# Altium schematic sheet MAIN.SchDoc
size A3; Organization: Electronic Research & Design; Address1: 11 Granofier; Address2: Zwartkop; Address3: Centurion; Address4: South Africa; Revision: 1; SheetNumber: 1; SheetTotal: 1; ProjectName: Flir
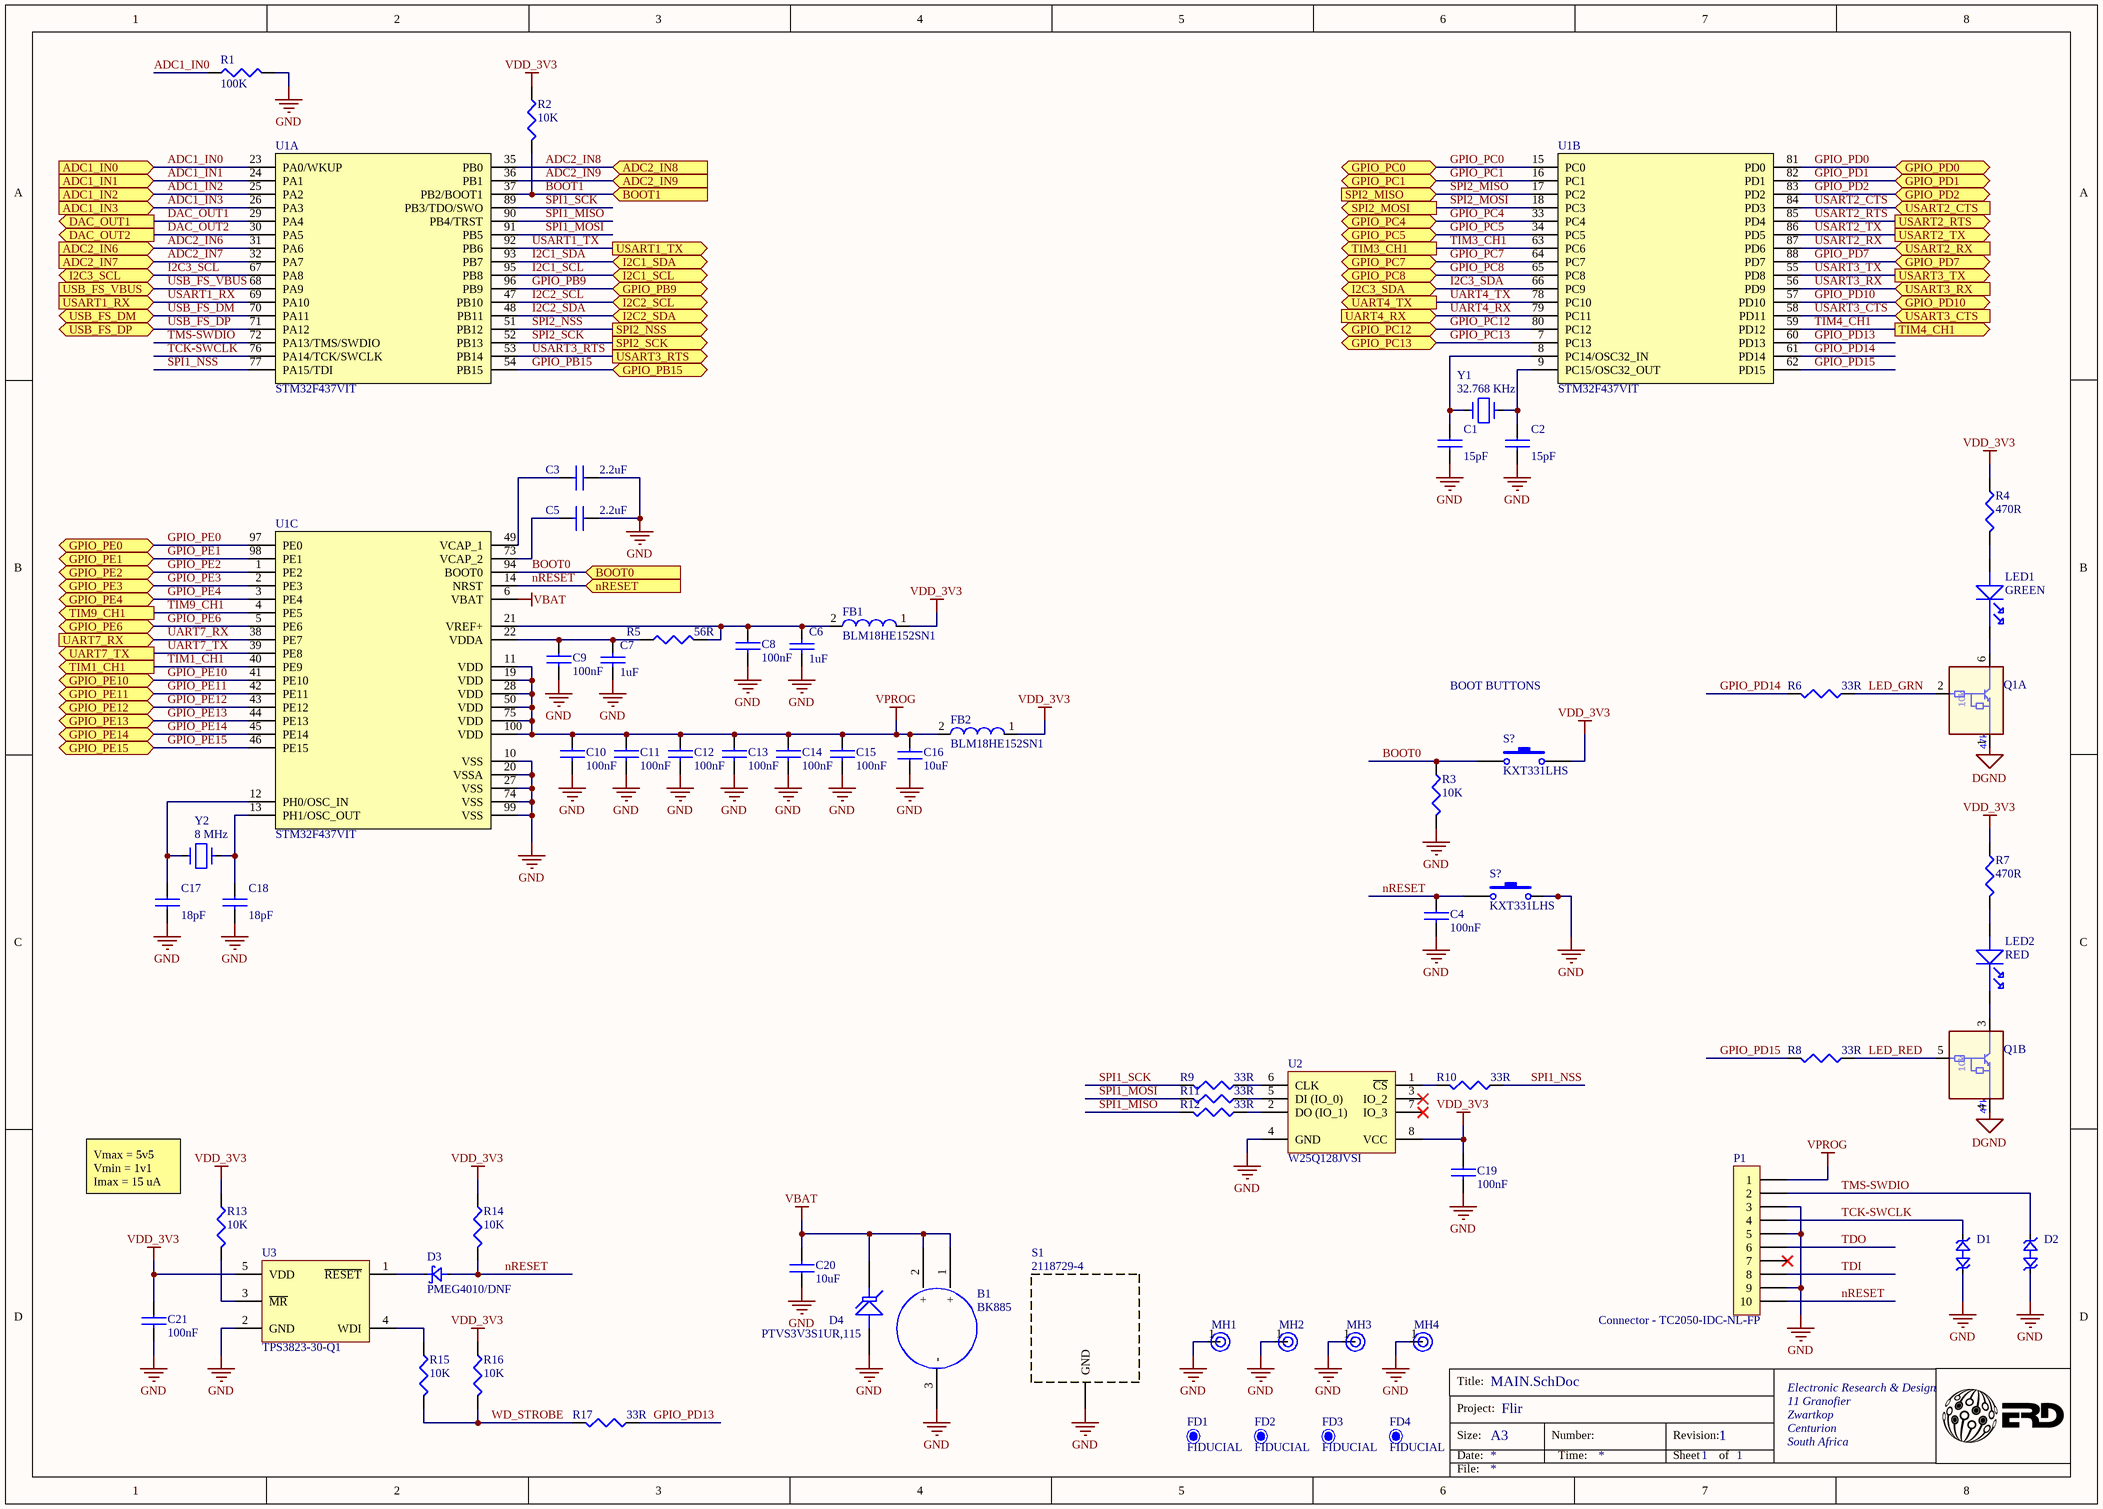
[diagram p0: MAIN.SchDoc]

## Parts
(Parts that share a designator on the sheet are numbered #1, #2 ... from top to bottom, then left to right.)
B1  BK885  [BK885]
C1  15pF  [CC0402]
C2  15pF  [CC0402]
C3  2.2uF  [CC0603]
C4  100nF  [CC0402]
C5  2.2uF  [CC0603]
C6  1uF  [CC0402]
C7  1uF  [CC0402]
C8  100nF  [CC0402]
C9  100nF  [CC0402]
C10  100nF  [CC0402]
C11  100nF  [CC0402]
C12  100nF  [CC0402]
C13  100nF  [CC0402]
C14  100nF  [CC0402]
C15  100nF  [CC0402]
C16  10uF  [CC0603]
C17  18pF  [CC0402]
C18  18pF  [CC0402]
C19  100nF  [CC0402]
C20  10uF  [CC0603]
C21  100nF  [CC0402]
D1  TPD1E10B06DPYR  [RC0402]  (value not drawn)
D2  TPD1E10B06DPYR  [RC0402]  (value not drawn)
D3  value PMEG4010/DNF  [SOD323]  (hidden comment: PMEG4010BEA)
D4  PTVS3V3S1UR,115  [SOD123W]
FB1  BLM18HE152SN1  [LC0603]
FB2  BLM18HE152SN1  [LC0603]
FD1  FIDUCIAL  [FIDUCIAL]
FD2  FIDUCIAL  [FIDUCIAL]
FD3  FIDUCIAL  [FIDUCIAL]
FD4  FIDUCIAL  [FIDUCIAL]
LED1  GREEN  [LED0603]
LED2  RED  [LED0603]
MH1  MH  [MH - M3]  (value not drawn)
MH2  MH  [MH - M3]  (value not drawn)
MH3  MH  [MH - M3]  (value not drawn)
MH4  MH  [MH - M3]  (value not drawn)
P1  Connector - TC2050-IDC-NL-FP  [Connector - TC2050-IDC-NL-FP]
Q1  DDC114YU-7-F  [SMini6-F3-B]  (value not drawn)  (parts A,B of 2)
R1  100K  [RC0402]
R2  10K  [RC0402]
R3  10K  [RC0402]
R4  470R  [RC0402]
R5  56R  [RC0402]
R6  33R  [RC0402]
R7  470R  [RC0402]
R8  33R  [RC0402]
R9  33R  [RC0402]
R10  33R  [RC0402]
R11  33R  [RC0402]
R12  33R  [RC0402]
R13  10K  [RC0402]
R14  10K  [RC0402]
R15  10K  [RC0402]
R16  10K  [RC0402]
R17  33R  [RC0402]
S1  2118729-4  [2118727-2]
S?#1  KXT331LHS  [KXT3]
S?#2  KXT331LHS  [KXT3]
U1  STM32F437VIT  [LQFP-100]  (parts A,B,C of 3)
U2  W25Q128JVSI  [SOIC-8 Wide]
U3  TPS3823-30-Q1  [SOT23-5]
Y1  32.768 KHz  [XTAL_SMD32]
Y2  8 MHz  [XTAL150SMD_125X196]

## Ports
ADC1_IN0 (in), ADC1_IN1 (in), ADC1_IN2 (in), ADC1_IN3 (in), ADC2_IN6 (in), ADC2_IN7 (in), ADC2_IN8 (in), ADC2_IN9 (in), BOOT0 (in), BOOT1 (in), DAC_OUT1 (out), DAC_OUT2 (out), GPIO_PB9 (bidir), GPIO_PB15 (bidir), GPIO_PC0 (bidir), GPIO_PC1 (bidir), GPIO_PC4 (bidir), GPIO_PC5 (bidir), GPIO_PC7 (bidir), GPIO_PC8 (bidir), GPIO_PC12 (bidir), GPIO_PC13 (bidir), GPIO_PD0 (bidir), GPIO_PD1 (bidir), GPIO_PD2 (bidir), GPIO_PD7 (bidir), GPIO_PD10 (bidir), GPIO_PE0 (bidir), GPIO_PE1 (bidir), GPIO_PE2 (bidir), GPIO_PE3 (bidir), GPIO_PE4 (bidir), GPIO_PE6 (bidir), GPIO_PE10 (bidir), GPIO_PE11 (bidir), GPIO_PE12 (bidir), GPIO_PE13 (bidir), GPIO_PE14 (bidir), GPIO_PE15 (bidir), I2C1_SCL (bidir), I2C1_SDA (bidir), I2C2_SCL (bidir), I2C2_SDA (bidir), I2C3_SCL (bidir), I2C3_SDA (bidir), nRESET (in), SPI2_MISO (in), SPI2_MOSI (out), SPI2_NSS (out), SPI2_SCK (out), TIM1_CH1 (out), TIM3_CH1 (out), TIM4_CH1 (out), TIM9_CH1 (out), UART4_RX (in), UART4_TX (out), UART7_RX (in), UART7_TX (out), USART1_RX (in), USART1_TX (out), USART2_CTS (in), USART2_RTS (out), USART2_RX (in), USART2_TX (out), USART3_CTS (in), USART3_RTS (out), USART3_RX (in), USART3_TX (out), USB_FS_DM (bidir), USB_FS_DP (bidir), USB_FS_VBUS (in)

## Nets
DGND: Q1.1 Q1.4
GND: B1.3(-) C1.2 C2.2 C3.1 C4.2 C5.1 C6.1 C7.1 C8.2 C9.2 C10.2 C11.2 C12.2 C13.2 C14.2 C15.2 C16.1 C17.2 C18.2 C19.2 C20.1 C21.2 D1.1 D2.1 D4.2 MH1.1 MH2.1 MH3.1 MH4.1 P1.3 P1.5 P1.9 R1.2 R3.2 S1.1(GND) S?#2.2 U1.10(VSS) U1.20(VSSA) U1.27(VSS) U1.74(VSS) U1.99(VSS) U2.4(GND) U3.2(GND)
VBAT: B1.1(+) B1.2(+) C20.2 D4.1 U1.6(VBAT)
VDD_3V3: C19.1 C21.1 FB1.1 FB2.1 R2.1 R4.1 R7.1 R13.1 R14.1 R16.1 S?#1.2 U2.8(VCC) U3.5(VDD)
VPROG: C10.1 C11.1 C12.1 C13.1 C14.1 C15.1 C16.2 FB2.2 P1.1 U1.11(VDD) U1.19(VDD) U1.28(VDD) U1.50(VDD) U1.75(VDD) U1.100(VDD)
ADC1_IN0: R1.1 U1.23(PA0/WKUP) ; port ADC1_IN0
ADC1_IN1: U1.24(PA1) ; port ADC1_IN1
ADC1_IN2: U1.25(PA2) ; port ADC1_IN2
ADC1_IN3: U1.26(PA3) ; port ADC1_IN3
ADC2_IN6: U1.31(PA6) ; port ADC2_IN6
ADC2_IN7: U1.32(PA7) ; port ADC2_IN7
ADC2_IN8: U1.35(PB0) ; port ADC2_IN8
ADC2_IN9: U1.36(PB1) ; port ADC2_IN9
BOOT0: R3.1 S?#1.1 U1.94(BOOT0) ; port BOOT0
BOOT1: R2.2 U1.37(PB2/BOOT1) ; port BOOT1
DAC_OUT1: U1.29(PA4) ; port DAC_OUT1
DAC_OUT2: U1.30(PA5) ; port DAC_OUT2
GPIO_PB9: U1.96(PB9) ; port GPIO_PB9
GPIO_PB15: U1.54(PB15) ; port GPIO_PB15
GPIO_PC0: U1.15(PC0) ; port GPIO_PC0
GPIO_PC1: U1.16(PC1) ; port GPIO_PC1
GPIO_PC4: U1.33(PC4) ; port GPIO_PC4
GPIO_PC5: U1.34(PC5) ; port GPIO_PC5
GPIO_PC7: U1.64(PC7) ; port GPIO_PC7
GPIO_PC8: U1.65(PC8) ; port GPIO_PC8
GPIO_PC12: U1.80(PC12) ; port GPIO_PC12
GPIO_PC13: U1.7(PC13) ; port GPIO_PC13
GPIO_PD0: U1.81(PD0) ; port GPIO_PD0
GPIO_PD1: U1.82(PD1) ; port GPIO_PD1
GPIO_PD2: U1.83(PD2) ; port GPIO_PD2
GPIO_PD7: U1.88(PD7) ; port GPIO_PD7
GPIO_PD10: U1.57(PD10) ; port GPIO_PD10
GPIO_PD13: R17.2 U1.60(PD13)
GPIO_PD14: R6.1 U1.61(PD14)
GPIO_PD15: R8.1 U1.62(PD15)
GPIO_PE0: U1.97(PE0) ; port GPIO_PE0
GPIO_PE1: U1.98(PE1) ; port GPIO_PE1
GPIO_PE2: U1.1(PE2) ; port GPIO_PE2
GPIO_PE3: U1.2(PE3) ; port GPIO_PE3
GPIO_PE4: U1.3(PE4) ; port GPIO_PE4
GPIO_PE6: U1.5(PE6) ; port GPIO_PE6
GPIO_PE10: U1.41(PE10) ; port GPIO_PE10
GPIO_PE11: U1.42(PE11) ; port GPIO_PE11
GPIO_PE12: U1.43(PE12) ; port GPIO_PE12
GPIO_PE13: U1.44(PE13) ; port GPIO_PE13
GPIO_PE14: U1.45(PE14) ; port GPIO_PE14
GPIO_PE15: U1.46(PE15) ; port GPIO_PE15
I2C1_SCL: U1.95(PB8) ; port I2C1_SCL
I2C1_SDA: U1.93(PB7) ; port I2C1_SDA
I2C2_SCL: U1.47(PB10) ; port I2C2_SCL
I2C2_SDA: U1.48(PB11) ; port I2C2_SDA
I2C3_SCL: U1.67(PA8) ; port I2C3_SCL
I2C3_SDA: U1.66(PC9) ; port I2C3_SDA
LED_GRN: Q1.2 R6.2
LED_RED: Q1.5 R8.2
nRESET: C4.1 D3.1(A) P1.10 R14.2 S?#2.1 U1.14(NRST) ; port nRESET
SPI1_MISO: R12.1 U1.90(PB4/TRST)
SPI1_MOSI: R11.1 U1.91(PB5)
SPI1_NSS: R10.2 U1.77(PA15/TDI)
SPI1_SCK: R9.1 U1.89(PB3/TDO/SWO)
SPI2_MISO: U1.17(PC2) ; port SPI2_MISO
SPI2_MOSI: U1.18(PC3) ; port SPI2_MOSI
SPI2_NSS: U1.51(PB12) ; port SPI2_NSS
SPI2_SCK: U1.52(PB13) ; port SPI2_SCK
TCK-SWCLK: D1.2 P1.4 U1.76(PA14/TCK/SWCLK)
TDI: P1.8
TDO: P1.6
TIM1_CH1: U1.40(PE9) ; port TIM1_CH1
TIM3_CH1: U1.63(PC6) ; port TIM3_CH1
TIM4_CH1: U1.59(PD12) ; port TIM4_CH1
TIM9_CH1: U1.4(PE5) ; port TIM9_CH1
TMS-SWDIO: D2.2 P1.2 U1.72(PA13/TMS/SWDIO)
UART4_RX: U1.79(PC11) ; port UART4_RX
UART4_TX: U1.78(PC10) ; port UART4_TX
UART7_RX: U1.38(PE7) ; port UART7_RX
UART7_TX: U1.39(PE8) ; port UART7_TX
USART1_RX: U1.69(PA10) ; port USART1_RX
USART1_TX: U1.92(PB6) ; port USART1_TX
USART2_CTS: U1.84(PD3) ; port USART2_CTS
USART2_RTS: U1.85(PD4) ; port USART2_RTS
USART2_RX: U1.87(PD6) ; port USART2_RX
USART2_TX: U1.86(PD5) ; port USART2_TX
USART3_CTS: U1.58(PD11) ; port USART3_CTS
USART3_RTS: U1.53(PB14) ; port USART3_RTS
USART3_RX: U1.56(PD9) ; port USART3_RX
USART3_TX: U1.55(PD8) ; port USART3_TX
USB_FS_DM: U1.70(PA11) ; port USB_FS_DM
USB_FS_DP: U1.71(PA12) ; port USB_FS_DP
USB_FS_VBUS: U1.68(PA9) ; port USB_FS_VBUS
WD_STROBE: R15.2 R16.2 R17.1
NetC1_1: C1.1 U1.8(PC14/OSC32_IN) Y1.1
NetC2_1: C2.1 U1.9(PC15/OSC32_OUT) Y1.2
NetC3_2: C3.2 U1.49(VCAP_1)
NetC5_2: C5.2 U1.73(VCAP_2)
NetC6_2: C6.2 C8.1 FB1.2 R5.2 U1.21(VREF+)
NetC7_2: C7.2 C9.1 R5.1 U1.22(VDDA)
NetC17_1: C17.1 U1.12(PH0/OSC_IN) Y2.1
NetC18_1: C18.1 U1.13(PH1/OSC_OUT) Y2.2
NetD3_2: D3.2(K) U3.1(~{RESET})
NetLED1_A: LED1.A R4.2
NetLED1_C: LED1.C Q1.6
NetLED2_A: LED2.A R7.2
NetLED2_C: LED2.C Q1.3
NetR9_2: R9.2 U2.6(CLK)
NetR10_1: R10.1 U2.1(~{CS})
NetR11_2: R11.2 U2.5(DI_(IO_0))
NetR12_2: R12.2 U2.2(DO_(IO_1))
NetR13_2: R13.2 U3.3(~{MR})
NetR15_1: R15.1 U3.4(WDI)

Not connected (* = marked no-connect by the designer): P1 7*; U2 3(IO_2)* 7(IO_3)*

## Notes on the sheet
- BOOT BUTTONS
- (near R13) Vmax = 5v5
  Vmin = 1v1
  Imax = 15 uA
- Title:
- Size:
- Date:
- Project:
- A3
- Number:
- Time:
- Revision:
- Sheet
- of
- File:
- (in symbol RN1907, part A) 10k; 47k
- (in symbol RN1907, part B) 10k; 47k

## Library data of the parts
B1 = CR2032RH1-LF: BATTER HOLDER, CR12xx, SMD; PartNumber: BK885
C1 C2 = CAP CER 2.2UF 6.3V 10% X5R 0402: CAP CER 15pF 6.3V 10% X5R 0402
C3 C5 = CAP CER 0.1UF 10V 10% X5R 0402: CAP CER 2.2UF 10V 20% X7R 0603; Manufacturer: TDK; PartNumber: C1608X7R1A225M080AE; Package / Case: 0603
C4 C8-C15 C19 C21 = CAP CER 0.1UF 10V 10% X5R 0402: CAP CER 0.1UF 50V 10% X7R 0402; Manufacturer: Murata; PartNumber: GCM155R71H104KE02D; Package / Case: 0402 (1005 Metric); Supplier: AAD
C6 C7 = CAPCERAMIC: CAP CER 1.0UF 10V 10% X5R 0402; PartNumber: GRM153R61A105ME95D
C16 C20 = CAP CER 0.1UF 10V 10% X5R 0402: CAP CER 10UF 25V 20% X5R 0603; Manufacturer: Murata; PartNumber: GRM188R61E106MA73D; Package / Case: 0603; Supplier: AAD
C17 C18 = CAP CER 2.2UF 6.3V 10% X5R 0402: CAP CER 18pF 50V 5% C0G 0402; Manufacturer: AVX; PartNumber: GJM1555C1H180FB01D; Package / Case: 0402 (1005 Metric); Supplier: AAD; Supplier Stock Code: N/A
D1 D2 = 1841: DIODE, TVS, 6V, 90W, 2SON; Manufacturer: Texas Instruments; Designator: DP?; Specification: ESD protection device; Vendor: AAD; PartNumber: TPD1E10B06DPYR; Component Type: ESD; ComponentLink2Description: Datasheet; ComponentLink2URL: C:\Users\martink.BOOYCO.000\Documents\Work\Altium libraries\Library and Database\Datasheets\Transient Protection\TPD1E10B06DPYR.pdf; Footprint: 0402_R; Pin Count: 2; Value: TPD1E10B06DPYR; Part/Order Number: TPD1E10B06DPYR
D3 = 463: Manufacturer: Phillips; Designator: D?; Specification: Diode, Schottky, 1000mA,  40V; Vendor: AAD; PartNumber: PMEG4010BEA; Component Type: Diode; ComponentLink2Description: Datasheet; ComponentLink2URL: C:\Users\martink.BOOYCO.000\Documents\Work\Altium libraries\Library and Database\Datasheets\Diodes\PMEG2010BEA_3010_4010.pdf; Pin Count: 2; Part/Order Number: PMEG4010BEA
D4 = Tranzorb: TVS, 3V3; PartNumber: PTVS3V3S1UR,115
FB1 FB2 = FER_180_200_0: FERRITE, 500mA, 500mOHM, 0603; PartNumber: BLM18HE152SN1
FD1-FD4 = FIDUCIAL: Fiducial 2mm; PartNumber: NA
LED1 = LED: LED, GRN, 65 mcd, 0603; PartNumber: LTST-C194KGKT; Color: GREEN
LED2 = LED: LED, GRN, 65 mcd, 0603; PartNumber: LTST-C194KRKT; Color: RED
MH1-MH4 = MountingHole: Mounting Hole; PartNumber: NA
P1 = 1848: TC2050-IDC; PartNumber: NA; Part/Order Number: NONE; Designator: J?; Note: NOT VERIFIED; Vendor: AAD; Value: Connector - TC2050-IDC-NL-FP; Component Type: Connector; ComponentLink2Description: Datasheet; ComponentLink2URL: C:\Users\martink.BOOYCO.000\Documents\Work\Altium\Library and Database\Datasheets\Connector\TC2050-IDC-NL Datasheet.pdf; Pin Count: 10; Specification: Connector - TC2050-IDC-NL-FP; Manufacturer: NONE
Q1 = RN1907: TRANS PREBIASED DUAL NPN SOT363; Manufacturer: Diodes Inc; Manufacturer Part Number: DDC114YU-7-F; Package / Case: 6-TSSOP, SC-88, SOT-363; Supplier: AAD; Supplier Stock Code: N/A
R1 = RES_10K_1/16W_1%_0402: RES, 100K OHM, 1/16W, 1%, 0402; Manufacturer: Yageo; PartNumber: RC0402FR-07100KL; Package / Case: 0402 (1005 Metric); Supplier: AAD
R2 R3 R13-R16 = RES_10K_1/16W_1%_0402: RES, 10K OHM, 1/16W, 1%, 0402; Manufacturer: Yageo; PartNumber: RC0402FR-0710KL; Package / Case: 0402 (1005 Metric); Supplier: AAD
R4 R7 = RES_10K_1/16W_1%_0402: RES 470 OHM 1/16W 1% 0402 SMD; Manufacturer: Yageo; PartNumber: RC0402FR-07470RL; Package / Case: 0402 (1005 Metric); Supplier: AAD; Supplier Stock Code: YAGA-80461
R5 = RES_10K_1/16W_1%_0402: RES, 56 OHM, 1/16W, 1%, 0402; Manufacturer: Yageo; PartNumber: RC0402FR-0756RL; Package / Case: 0402 (1005 Metric); Supplier: AAD
R6 R8-R12 R17 = RES_10K_1/16W_1%_0402: RES, 33 OHM, 1/16W, 1%, 0402; Manufacturer: Yageo; PartNumber: RC0402FR-0733RL; Package / Case: 0402 (1005 Metric); Supplier: AAD
S1 = BMI-S-206-F: RF Shield, 31.1mm x 44.6mm x 2mm; PartNumber: 2118729-4
S?#1 S?#2 = SW-PB: Switch; Published: 24-Mar-1999; LatestRevisionDate: 17-Jul-2002; LatestRevisionNote: Re-released for DXP Platform.; PackageReference: SPST-2; Publisher: Altium Limited; PackageDescription: Switch; 2 Leads; PartNumber: KXT331LHS
U1 = STM32F437VIT: MCU, Cortex-M4, LQFP-100; PartNumber: STM32F437VIT
U2 = W25Q128JV: 3V, 128-MBit, Serial Flash Memory, SOIC-8 W; PartNumber: W25Q128JVSI
U3 = TPS3823-30-Q1: Voltage Monitor with Watchdog timer, SOT-23 (5); PartNumber: TPS3823-30-Q1
Y1 = 458: Crystal, 32.768 kHz, 20ppm, 15pF, 2-SMD; PartNumber: TZ1006A; Value: 32.768 KHz
Y2 = 458: Crystal, 8 MHz, 20ppm, 18pF, 2-SMD; Part Number: ABM3-8.000MHZ-D2Y; Value: 8 MHz